# Altium schematic sheet SH07 - OMAP-L137 USB1.SchDoc
size 386 x 246 mm
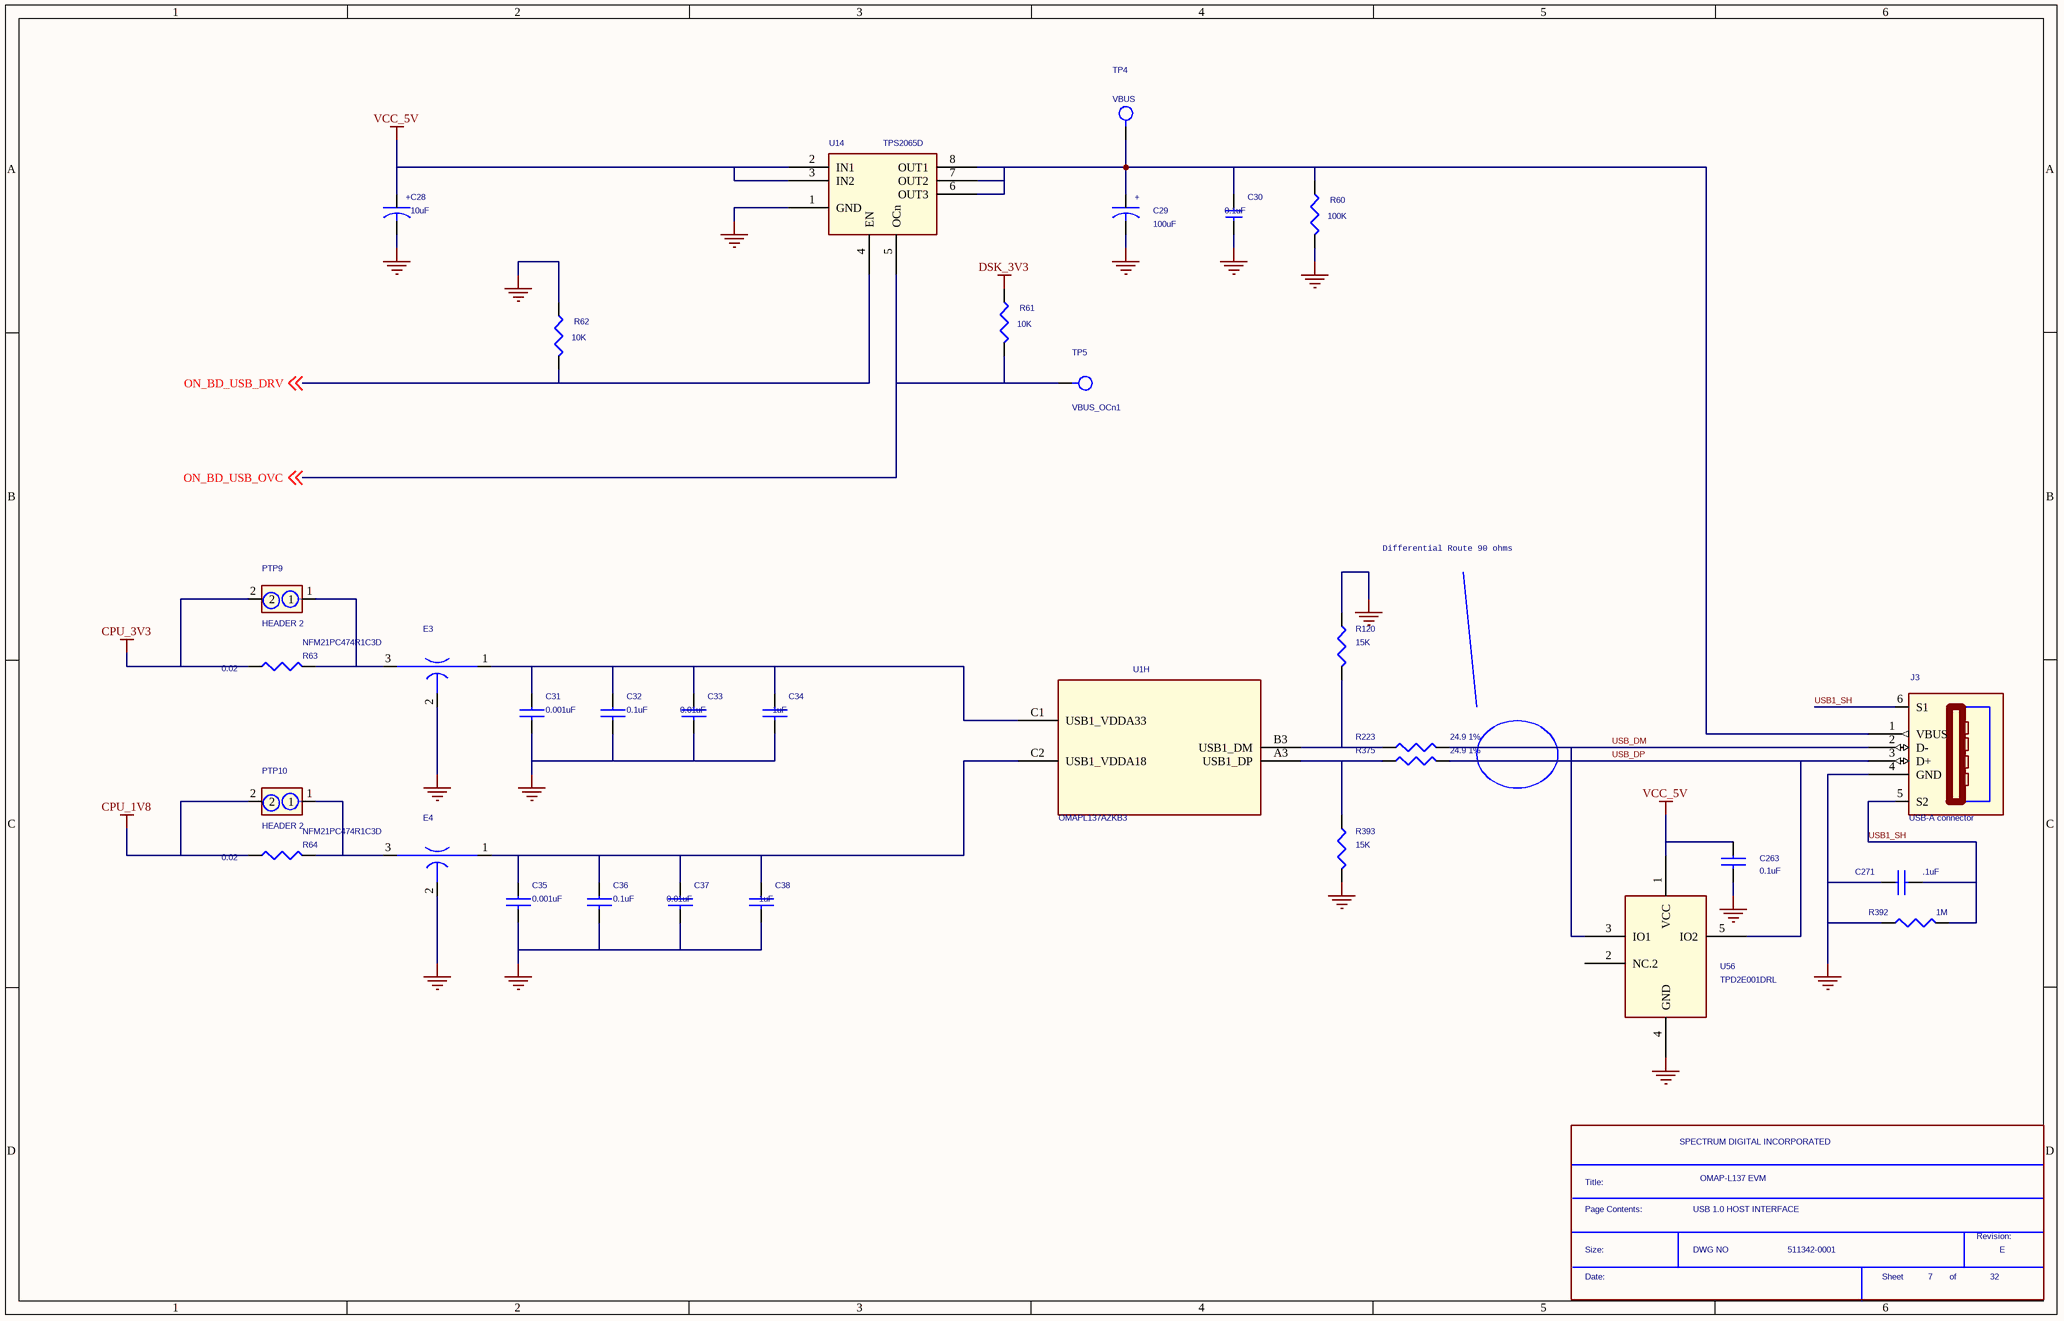
[diagram p0: SH07 - OMAP-L137 USB1.SchDoc]

## Parts
*  Page Contents:: USB 1.0 HOST INTERFACE  RevCode: E  Title: OMAP-L137 EVM  OrgName: SPECTRUM DIGITAL INCORPORATED  Doc: 511342-0001  Page Number: 7  Page Count: 32  (hidden comment: SDTitleBlock)  (graphical)
C28  10uF  [EIA-A]
C29  100uF  [EIA-A]
C30  0.1uF  [0603]
C31  0.001uF  [c402-25]
C32  0.1uF  [c402-25]
C33  0.01uF  [c402-25]
C34  1uF  [c603-35x45]
C35  0.001uF  [c402-25]
C36  0.1uF  [c402-25]
C37  0.01uF  [c402-25]
C38  1uF  [c603-35x45]
C263  0.1uF  [c402-25]
C271  .1uF  [C0603]
E3  NFM21PC474R1C3D  [emi-NFM21p]
E4  NFM21PC474R1C3D  [emi-NFM21p]
J3  USB-A connector  [USB-B]
PTP9  HEADER 2  [JUMP1X2-6040]
PTP10  HEADER 2  [JUMP1X2-6040]
R60  100K  [r402-25]
R61  10K  [r402-25]
R62  10K  [r402-25]
R63  0.02  [r1206-40x70]
R64  0.02  [r1206-40x70]
R120  15K  [r402-25]
R223  24.9 1%  [r402-25]
R375  24.9 1%  [r402-25]
R392  1M  [r603-35x45]
R393  15K  [r402-25]
TP4  VBUS  [tp1-6040]
TP5  VBUS_OCn1  [tp1-6040]
U1  OMAPL137AZKB3  [skt256-6064]  (part H of 9)
U14  TPS2065D  [so8-25x75]
U56  TPD2E001DRL  [drl5-12x40]

## Nets
CPU_1V8: PTP10.2 R64.2
CPU_3V3: PTP9.2 R63.2
DSK_3V3: R61.1
GND: C28.2 C29.2 C30.2 C31.2 C32.2 C33.2 C34.2 C35.2 C36.2 C37.2 C38.2 C263.2 C271.1 E3.2 E4.2 J3.4(GND) R60.2 R62.1 R120.1 R392.1 R393.2 U14.1(GND) U56.4(GND)
VCC_5V: C28.1 C263.1 U14.2(IN1) U14.3(IN2) U56.1(VCC)
ON_BD_USB_DRV: R62.2 U14.4(EN) ; off-sheet ON_BD_USB_DRV
ON_BD_USB_OVC: R61.2 TP5.1(PIN) U14.5(OCn) ; off-sheet ON_BD_USB_OVC
USB1_SH: C271.2 J3.5(S2) J3.6(S1) R392.2
USB_DM: J3.2(D-) R223.2 U56.3(IO1)
USB_DP: J3.3(D+) R375.2 U56.5(IO2)
NetC29_1: C29.1 C30.1 J3.1(VBUS) R60.1 TP4.1(PIN) U14.6(OUT3) U14.7(OUT2) U14.8(OUT1)
NetC31_1: C31.1 C32.1 C33.1 C34.1 E3.1 U1.C1(USB1_VDDA33)
NetC35_1: C35.1 C36.1 C37.1 C38.1 E4.1 U1.C2(USB1_VDDA18)
NetE3_3: E3.3 PTP9.1 R63.1
NetE4_3: E4.3 PTP10.1 R64.1
NetR120_2: R120.2 R223.1 U1.B3(USB1_DM)
NetR375_1: R375.1 R393.1 U1.A3(USB1_DP)

Not connected (* = marked no-connect by the designer): U56 2(NC.2)

## Notes on the sheet
- Differential Route 90 ohms
- (in symbol Cap 4_1.7uF Tan 10V 20% EIA_A) +
- (in symbol SDTitleBlock) Title:; Page Contents:; Revision:; Size:; DWG NO; Date:; Sheet; of

## Library data of the parts
C28 = Cap 4_1.7uF Tan 10V 20% EIA_A: 4.7uF Capacitor, Tantalum, 10V, 20%; NCPartnumber: EIA_A; Mfr: Panasonic; PartName: Cap 4.7uF Tan 10V 20% EIA_A; MfrNum: ECS-T1AY475R; Part #: 101003-0101R; Cost10K: 0.257; Cost100: 0.418; Vendor: xxxx; VendorNum: PCS2475CT-ND; SD PCB Footprint: EIA1206
C29 = Cap 4_1.7uF Tan 10V 20% EIA_A: 4.7uF Capacitor, Tantalum, 10V, 20%; NCPartnumber: EIA_A; Mfr: Panasonic; PartName: Cap 4.7uF Tan 10V 20% EIA_A; MfrNum: ECS-T1AY475R; Part #: 101608-0102R; Cost10K: 0.257; Cost100: 0.418; Vendor: xxxx; VendorNum: PCS2475CT-ND; SD PCB Footprint: EIA1206
C30 = Cap 100nF Cermc 16V 10% 603: 0.1uF Capacitor, Ceramic, 16V, 10%, 0603; MfrNum: ECJ-1VB1C104K; Mfr: Panasonic; NCPartnumber: 1C0056; Part #: 101587-1100R; VendorNum: PCC1762CT-ND; Vendor: Digikey; Cost100: 0.0694; Cost10K: 0.038; TI Footprint: c603-35x45; SD PCB Footprint: EIA0402; PartName: Cap 100nF Cermc 16V 10% 603
C31 C35 = CAP NP: Part #: 102058-1102R
C32 C36 = CAP NP: Part #: 101587-1100R
C33 C37 = CAP NP: Part #: 101587-1101R
C34 C38 = CAP NP: Part #: 101007-0100R
C263 = CAP NP_0: Part #: 101587-1100R
C271 = CAP .1 uF 10% 0603: Part #: 101587-1100R
E3 E4 = NFM_1: Part #: 102569-1470R
J3 = USB-A connector: USB Device Connector Right Angle PCB Mount; PartName: USB  Connector; Mfr: AMP; MfrNum: 787780-1; Part #: 101678-0001R; Vendor: Digikey; VendorNum: 787780-1-ND
PTP9 PTP10 = PTP2: Single Line Header 2pin Tin; NCPartnumber: 2H0000; MfrNum: PTC02SAAN; Mfr: Sullins; Cost10K: 0.252; Vendor: Digikey; Cost100: 0.252; PartName: HEADER2Pin
R60 = R: Part #: 101370-1004R
R61 R62 = R: Part #: 101370-1003R
R63 R64 = R: Part #: 102598-0002R
R120 R393 = R
R223 R375 = R: Part #: 102145-2490R
R392 = R: Part #: 100642-1005R
TP4 = Test Point_1: TEST POINT 0.100; PartName: HEADER 1; Part #: 100115-0001R; Mfr: Sullins; MfrNum: PZC36DAAN; Vendor: Digikey; Vendor Nbr: S2111-36-ND; SD PCB Footprint: CON1; Assy_NO-POP: Do Not Populate; VendorNum: S2011-36-ND; Cost100: 0.031; Cost10K: 0.018; ION Footprint: tp1-6040; TI Footprint: tp1-6040
TP5 = Test Point_1: TEST POINT 0.100; PartName: HEADER 1; MfrNum: PZC36DAAN; Mfr: Sullins; Part #: 100115-0001R; Vendor: Digikey; Vendor Nbr: S2111-36-ND; Cost10K: 0.018; Cost100: 0.031; VendorNum: S2011-36-ND; Assy_NO-POP: Do Not Populate; SD PCB Footprint: CON1; TI Footprint: tp1-6040; ION Footprint: tp1-6040
U1 = PRIMUS_BGA_1: Part #: 102772-0001; SWAP_INFO: (S1+S2+S3+S4+S5+S6+S7+S8+S9); SPLIT_INST: TRUE
U14 = tps2061_1: Part #: 102810-0001R
U56 = TPDE0001RSE_0: Part #: 102728-0001R